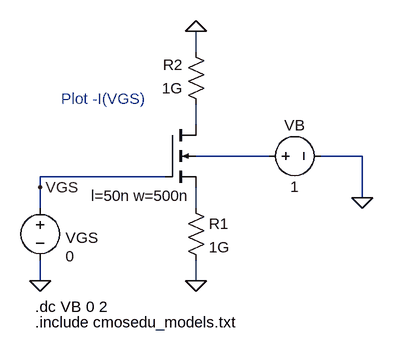
[diagram p0: schematic Fig16_67.asc]
Fig16_67.asc, the LTspice schematic file:
Version 4
SHEET 1 1748 680
WIRE 624 -336 624 -368
WIRE 624 -224 624 -256
WIRE 736 -176 624 -176
WIRE 880 -176 816 -176
WIRE 576 -144 384 -144
WIRE 384 -128 384 -144
WIRE 880 -112 880 -176
WIRE 384 -96 384 -128
WIRE 624 -96 624 -128
WIRE 384 16 384 -16
WIRE 624 16 624 -16
FLAG 384 16 0
FLAG 384 -128 VGS
FLAG 880 -112 0
FLAG 624 16 0
FLAG 624 -368 0
SYMBOL nmos4 576 -224 R0
WINDOW 0 104 24 Invisible 0
WINDOW 3 179 41 Invisible 0
WINDOW 123 -114 109 Left 0
SYMATTR InstName M1
SYMATTR Value N_50n
SYMATTR Value2 l=50n w=500n
SYMBOL voltage 384 -112 R0
WINDOW 123 0 0 Left 0
WINDOW 39 0 0 Left 0
WINDOW 3 39 90 Left 0
WINDOW 0 39 62 Left 0
SYMATTR Value 0
SYMATTR InstName VGS
SYMBOL res 608 -112 R0
SYMATTR InstName R1
SYMATTR Value 1G
SYMBOL voltage 720 -176 R270
WINDOW 0 32 56 VTop 0
WINDOW 3 -32 56 VBottom 0
SYMATTR InstName VB
SYMATTR Value 1
SYMBOL res 640 -240 R180
WINDOW 0 36 76 Left 0
WINDOW 3 36 40 Left 0
SYMATTR InstName R2
SYMATTR Value 1G
TEXT 376 80 Left 0 !.include cmosedu_models.txt
TEXT 376 56 Left 0 !.dc VB 0 2 
TEXT 416 -264 Left 0 ;Plot -I(VGS)

The netlist it stands for:
* Fig16_67.asc
M1 N001 VGS N003 N002 N_50n l=50n w=500n
VGS VGS 0 0
R1 N003 0 1G
VB N002 0 1
R2 N001 0 1G
.model NMOS NMOS
.model PMOS PMOS
.lib standard.mos
.include cmosedu_models.txt
.dc VB 0 2
* Plot -I(VGS)
.backanno
.end